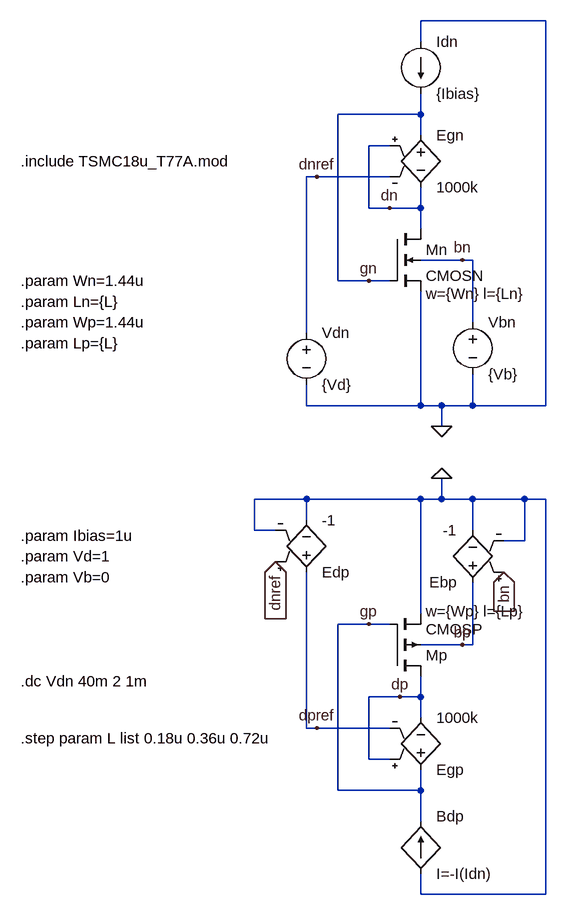
[diagram p0: schematic gm_over_go.mos18u.asc]
gm_over_go.mos18u.asc, the LTspice schematic file:
Version 4
SHEET 1 2088 996
WIRE 1456 -416 1264 -416
WIRE 1264 -384 1264 -416
WIRE 1264 -272 1264 -304
WIRE 1264 -272 1136 -272
WIRE 1264 -240 1264 -272
WIRE 1216 -224 1184 -224
WIRE 1104 -176 1088 -176
WIRE 1216 -176 1104 -176
WIRE 1184 -128 1184 -224
WIRE 1216 -128 1184 -128
WIRE 1264 -128 1264 -160
WIRE 1264 -128 1216 -128
WIRE 1264 -96 1264 -128
WIRE 1328 -48 1264 -48
WIRE 1344 -48 1328 -48
WIRE 1136 -16 1136 -272
WIRE 1184 -16 1136 -16
WIRE 1216 -16 1184 -16
WIRE 1344 48 1344 -48
WIRE 1088 64 1088 -176
WIRE 1088 176 1088 144
WIRE 1264 176 1264 0
WIRE 1264 176 1088 176
WIRE 1296 176 1264 176
WIRE 1344 176 1344 128
WIRE 1344 176 1296 176
WIRE 1456 176 1456 -416
WIRE 1456 176 1344 176
WIRE 1296 208 1296 176
WIRE 1088 320 1008 320
WIRE 1264 320 1088 320
WIRE 1296 320 1296 288
WIRE 1296 320 1264 320
WIRE 1344 320 1296 320
WIRE 1424 320 1344 320
WIRE 1456 320 1424 320
WIRE 1088 352 1088 320
WIRE 1008 368 1008 320
WIRE 1040 368 1008 368
WIRE 1344 368 1344 320
WIRE 1424 384 1424 320
WIRE 1424 384 1392 384
WIRE 1264 496 1264 320
WIRE 1184 512 1136 512
WIRE 1216 512 1184 512
WIRE 1328 544 1264 544
WIRE 1344 544 1344 448
WIRE 1344 544 1328 544
WIRE 1232 624 1184 624
WIRE 1264 624 1264 592
WIRE 1264 624 1232 624
WIRE 1264 656 1264 624
WIRE 1088 672 1088 432
WIRE 1104 672 1088 672
WIRE 1216 672 1104 672
WIRE 1184 720 1184 624
WIRE 1216 720 1184 720
WIRE 1136 768 1136 512
WIRE 1264 768 1264 736
WIRE 1264 768 1136 768
WIRE 1264 816 1264 768
WIRE 1264 928 1264 896
WIRE 1456 928 1456 320
WIRE 1456 928 1264 928
FLAG 1296 208 0
FLAG 1184 -16 gn
FLAG 1216 -128 dn
FLAG 1104 -176 dnref
FLAG 1328 -48 bn
FLAG 1296 288 0
FLAG 1184 512 gp
FLAG 1232 624 dp
FLAG 1104 672 dpref
FLAG 1328 544 bp
FLAG 1040 416 dnref
IOPIN 1040 416 In
FLAG 1392 432 bn
IOPIN 1392 432 In
SYMBOL nmos4 1216 -96 R0
WINDOW 123 56 100 Left 2
SYMATTR Value2 w={Wn} l={Ln}
SYMATTR InstName Mn
SYMATTR Value CMOSN
SYMBOL voltage 1088 48 R0
SYMATTR InstName Vdn
SYMATTR Value {Vd}
SYMBOL e 1264 -256 R0
SYMATTR InstName Egn
SYMATTR Value 1000k
SYMBOL current 1264 -384 R0
SYMATTR InstName Idn
SYMATTR Value {Ibias}
SYMBOL voltage 1344 32 R0
SYMATTR InstName Vbn
SYMATTR Value {Vb}
SYMBOL e 1264 752 M180
SYMATTR InstName Egp
SYMATTR Value 1000k
SYMBOL pmos4 1216 592 M180
WINDOW 123 56 100 Left 2
SYMATTR Value2 w={Wp} l={Lp}
SYMATTR InstName Mp
SYMATTR Value CMOSP
SYMBOL e 1088 448 M180
SYMATTR InstName Edp
SYMATTR Value -1
SYMBOL e 1344 464 R180
SYMATTR InstName Ebp
SYMATTR Value -1
SYMBOL bi 1264 896 M180
WINDOW 0 24 88 Left 2
WINDOW 3 24 0 Left 2
SYMATTR InstName Bdp
SYMATTR Value I=-I(Idn)
TEXT 648 376 Left 2 !.param Ibias=1u
TEXT 648 408 Left 2 !.param Vd=1
TEXT 648 600 Left 2 !.dc Vdn 40m 2 1m
TEXT 648 440 Left 2 !.param Vb=0
TEXT 648 -16 Left 2 !.param Wn=1.44u
TEXT 648 16 Left 2 !.param Ln={L}
TEXT 648 48 Left 2 !.param Wp=1.44u
TEXT 648 80 Left 2 !.param Lp={L}
TEXT 648 688 Left 2 !.step param L list 0.18u 0.36u 0.72u
TEXT 648 -200 Left 2 !.include TSMC18u_T77A.mod

The netlist it stands for:
* gm_over_go.mos18u.asc
Mn dn gn 0 bn CMOSN w={Wn} l={Ln}
Vdn dnref 0 {Vd}
Egn gn dn dn dnref 1000k
Idn 0 gn {Ibias}
Vbn bn 0 {Vb}
Egp gp dp dp dpref 1000k
Mp dp gp 0 bp CMOSP w={Wp} l={Lp}
Edp dpref 0 dnref 0 -1
Ebp bp 0 bn 0 -1
Bdp 0 gp I=-I(Idn)
.model NMOS NMOS
.model PMOS PMOS
.lib standard.mos
.param Ibias=1u
.param Vd=1
.dc Vdn 40m 2 1m
.param Vb=0
.param Wn=1.44u
.param Ln={L}
.param Wp=1.44u
.param Lp={L}
.step param L list 0.18u 0.36u 0.72u
.include TSMC18u_T77A.mod
.backanno
.end